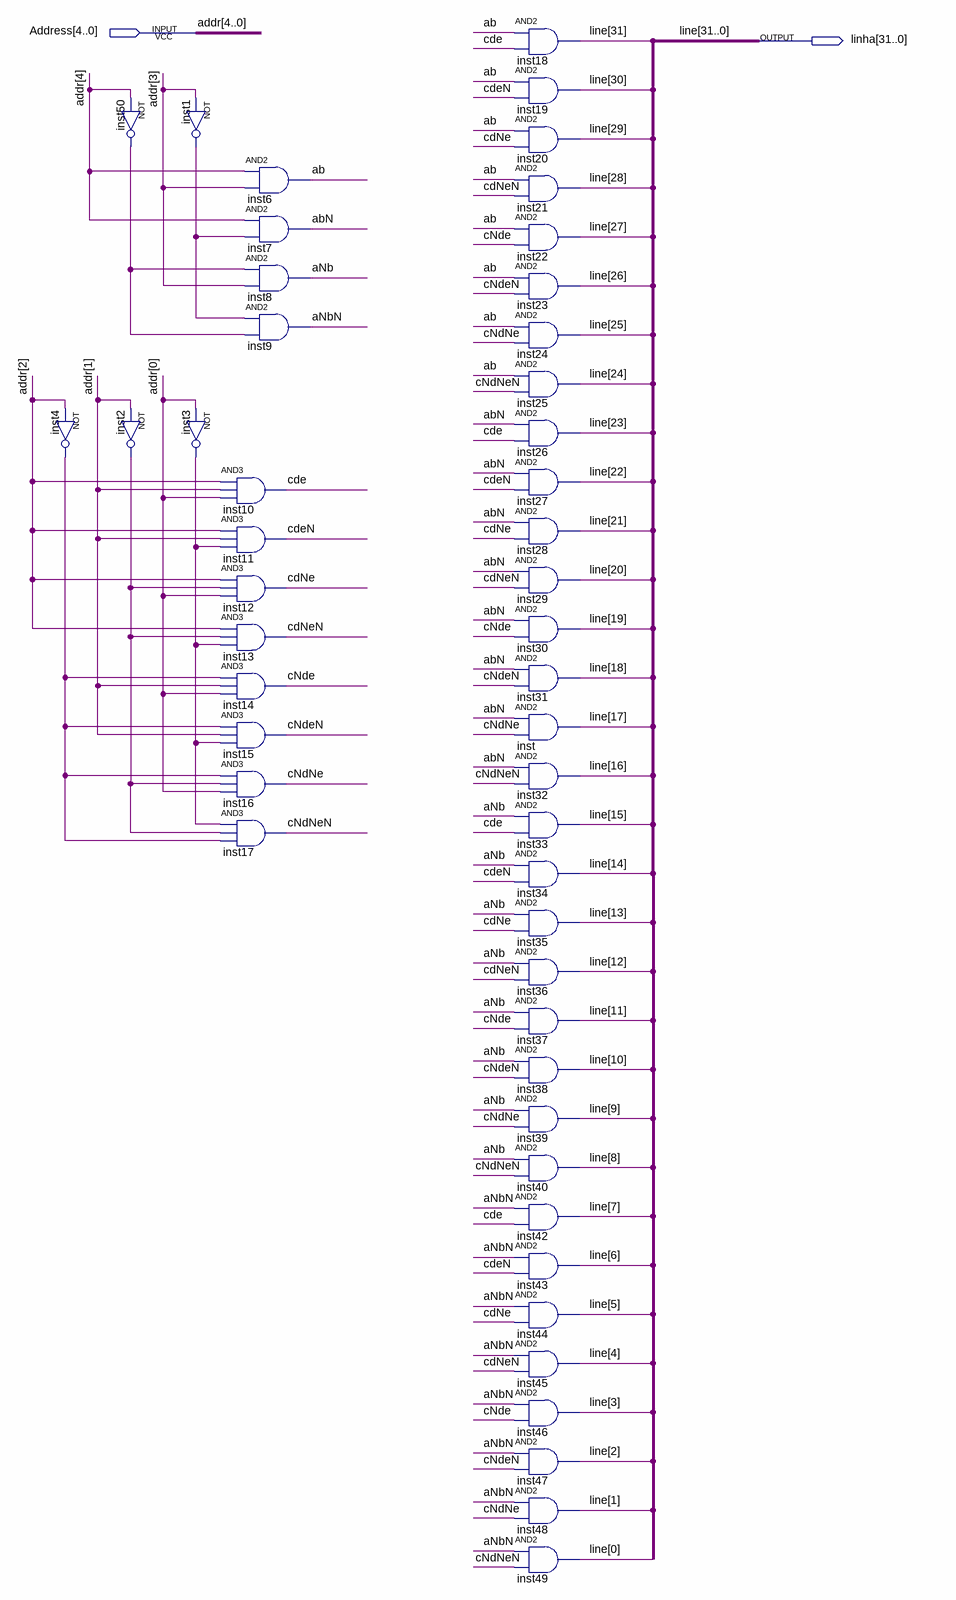
[diagram p0: schematic sheet]
// Quartus schematic DecodificadorDeEndereco.bdf as structural Verilog: 49 symbols, 2 pins
module DecodificadorDeEndereco (
  input  [4:0] Address,
  output [31:0] linha
);

  wire ab, abN, aNb, aNbN, cde, cdeN, cdNe, cdNeN, cNde, cNdeN, cNdNe, cNdNeN, inst1_out, inst2_out,
       inst3_out, inst4_out, inst50_out;

  not inst4 (inst4_out, Address[2]);
  not inst50 (inst50_out, Address[4]);
  not inst2 (inst2_out, Address[1]);
  not inst1 (inst1_out, Address[3]);
  not inst3 (inst3_out, Address[0]);
  and inst6 (ab, Address[4], Address[3]);
  and inst7 (abN, Address[4], inst1_out);
  and inst8 (aNb, inst50_out, Address[3]);
  and inst9 (aNbN, inst1_out, inst50_out);
  and inst10 (cde, Address[2], Address[1], Address[0]);
  and inst11 (cdeN, Address[2], Address[1], inst3_out);
  and inst12 (cdNe, Address[2], inst2_out, Address[0]);
  and inst13 (cdNeN, Address[2], inst2_out, inst3_out);
  and inst14 (cNde, inst4_out, Address[1], Address[0]);
  and inst15 (cNdeN, inst4_out, Address[1], inst3_out);
  and inst16 (cNdNe, inst4_out, inst2_out, Address[0]);
  and inst17 (cNdNeN, inst3_out, inst2_out, inst4_out);
  and inst18 (linha[31], ab, cde);
  and inst19 (linha[30], ab, cdeN);
  and inst20 (linha[29], ab, cdNe);
  and inst21 (linha[28], ab, cdNeN);
  and inst22 (linha[27], ab, cNde);
  and inst23 (linha[26], ab, cNdeN);
  and inst24 (linha[25], ab, cNdNe);
  and inst25 (linha[24], ab, cNdNeN);
  and inst26 (linha[23], abN, cde);
  and inst27 (linha[22], abN, cdeN);
  and inst28 (linha[21], abN, cdNe);
  and inst29 (linha[20], abN, cdNeN);
  and inst30 (linha[19], abN, cNde);
  and inst31 (linha[18], abN, cNdeN);
  and inst (linha[17], abN, cNdNe);
  and inst32 (linha[16], abN, cNdNeN);
  and inst33 (linha[15], aNb, cde);
  and inst34 (linha[14], aNb, cdeN);
  and inst35 (linha[13], aNb, cdNe);
  and inst36 (linha[12], aNb, cdNeN);
  and inst37 (linha[11], aNb, cNde);
  and inst38 (linha[10], aNb, cNdeN);
  and inst39 (linha[9], aNb, cNdNe);
  and inst40 (linha[8], aNb, cNdNeN);
  and inst42 (linha[7], aNbN, cde);
  and inst43 (linha[6], aNbN, cdeN);
  and inst44 (linha[5], aNbN, cdNe);
  and inst45 (linha[4], aNbN, cdNeN);
  and inst46 (linha[3], aNbN, cNde);
  and inst47 (linha[2], aNbN, cNdeN);
  and inst48 (linha[1], aNbN, cNdNe);
  and inst49 (linha[0], aNbN, cNdNeN);

  // Other names for the same wires on the sheet: addr[4:0] = Address; line[31:0] = linha
endmodule
